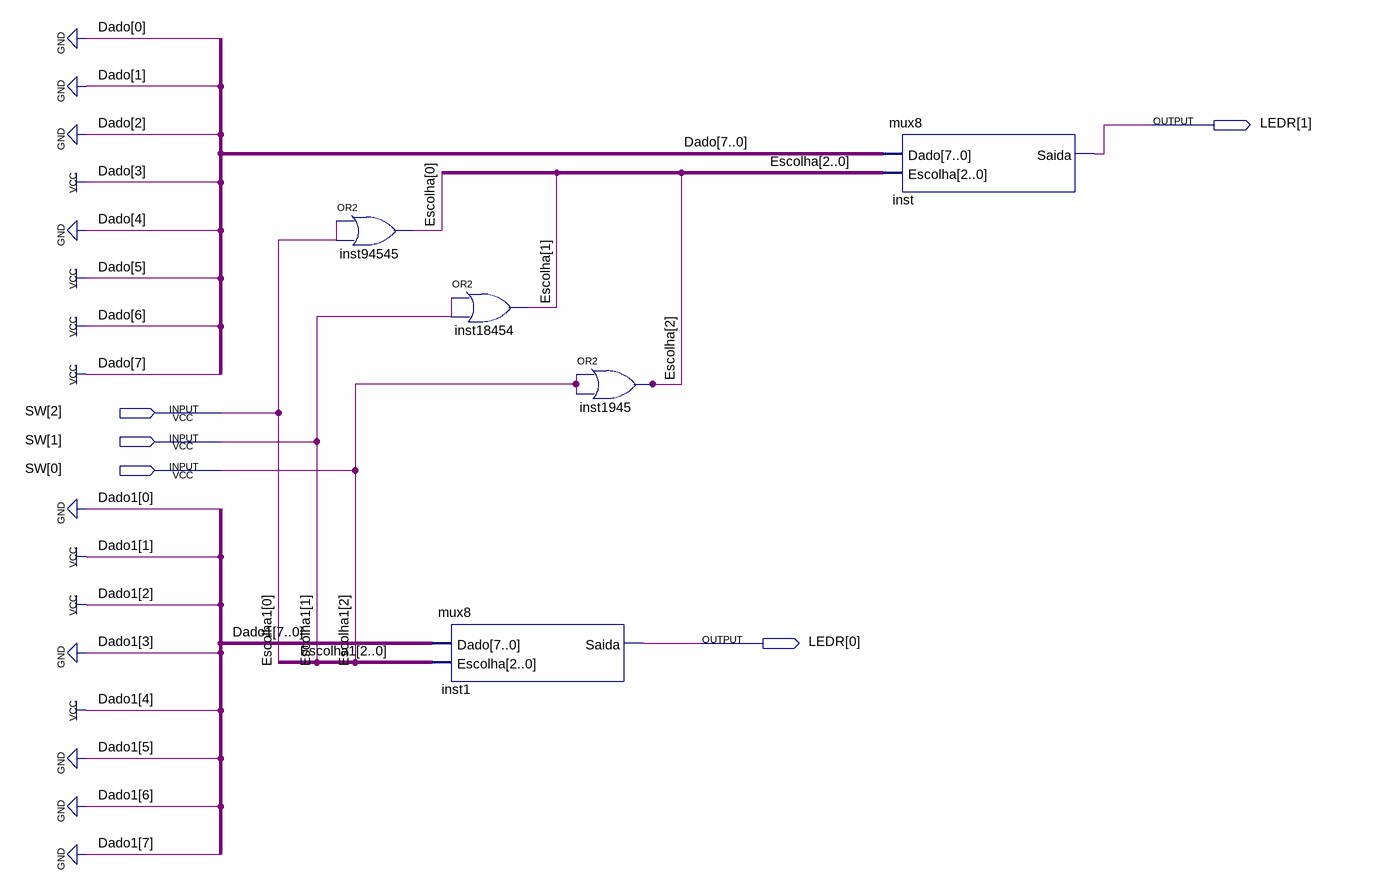
[diagram p0: schematic sheet]
// Quartus schematic fulladd21placa.bdf as structural Verilog: 5 symbols, 5 pins
module fulladd21placa (
  input  [2:0] SW,
  output [1:0] LEDR
);

  wire [2:0] Escolha;

  or inst94545 (Escolha[0], SW[2], SW[2]);
  mux8 inst1 (.Dado(8'b00010110), .Escolha({SW[0], SW[1], SW[2]}), .Saida(LEDR[0]));
  or inst18454 (Escolha[1], SW[1], SW[1]);
  or inst1945 (Escolha[2], SW[0], SW[0]);
  mux8 inst (.Dado(8'b11101000), .Escolha(Escolha), .Saida(LEDR[1]));

  // Other names for the same wires on the sheet: Escolha1[2:0] = {SW[0], SW[1], SW[2]}
endmodule
